# Altium schematic sheet 3 - USB.SchDoc
size Tabloid
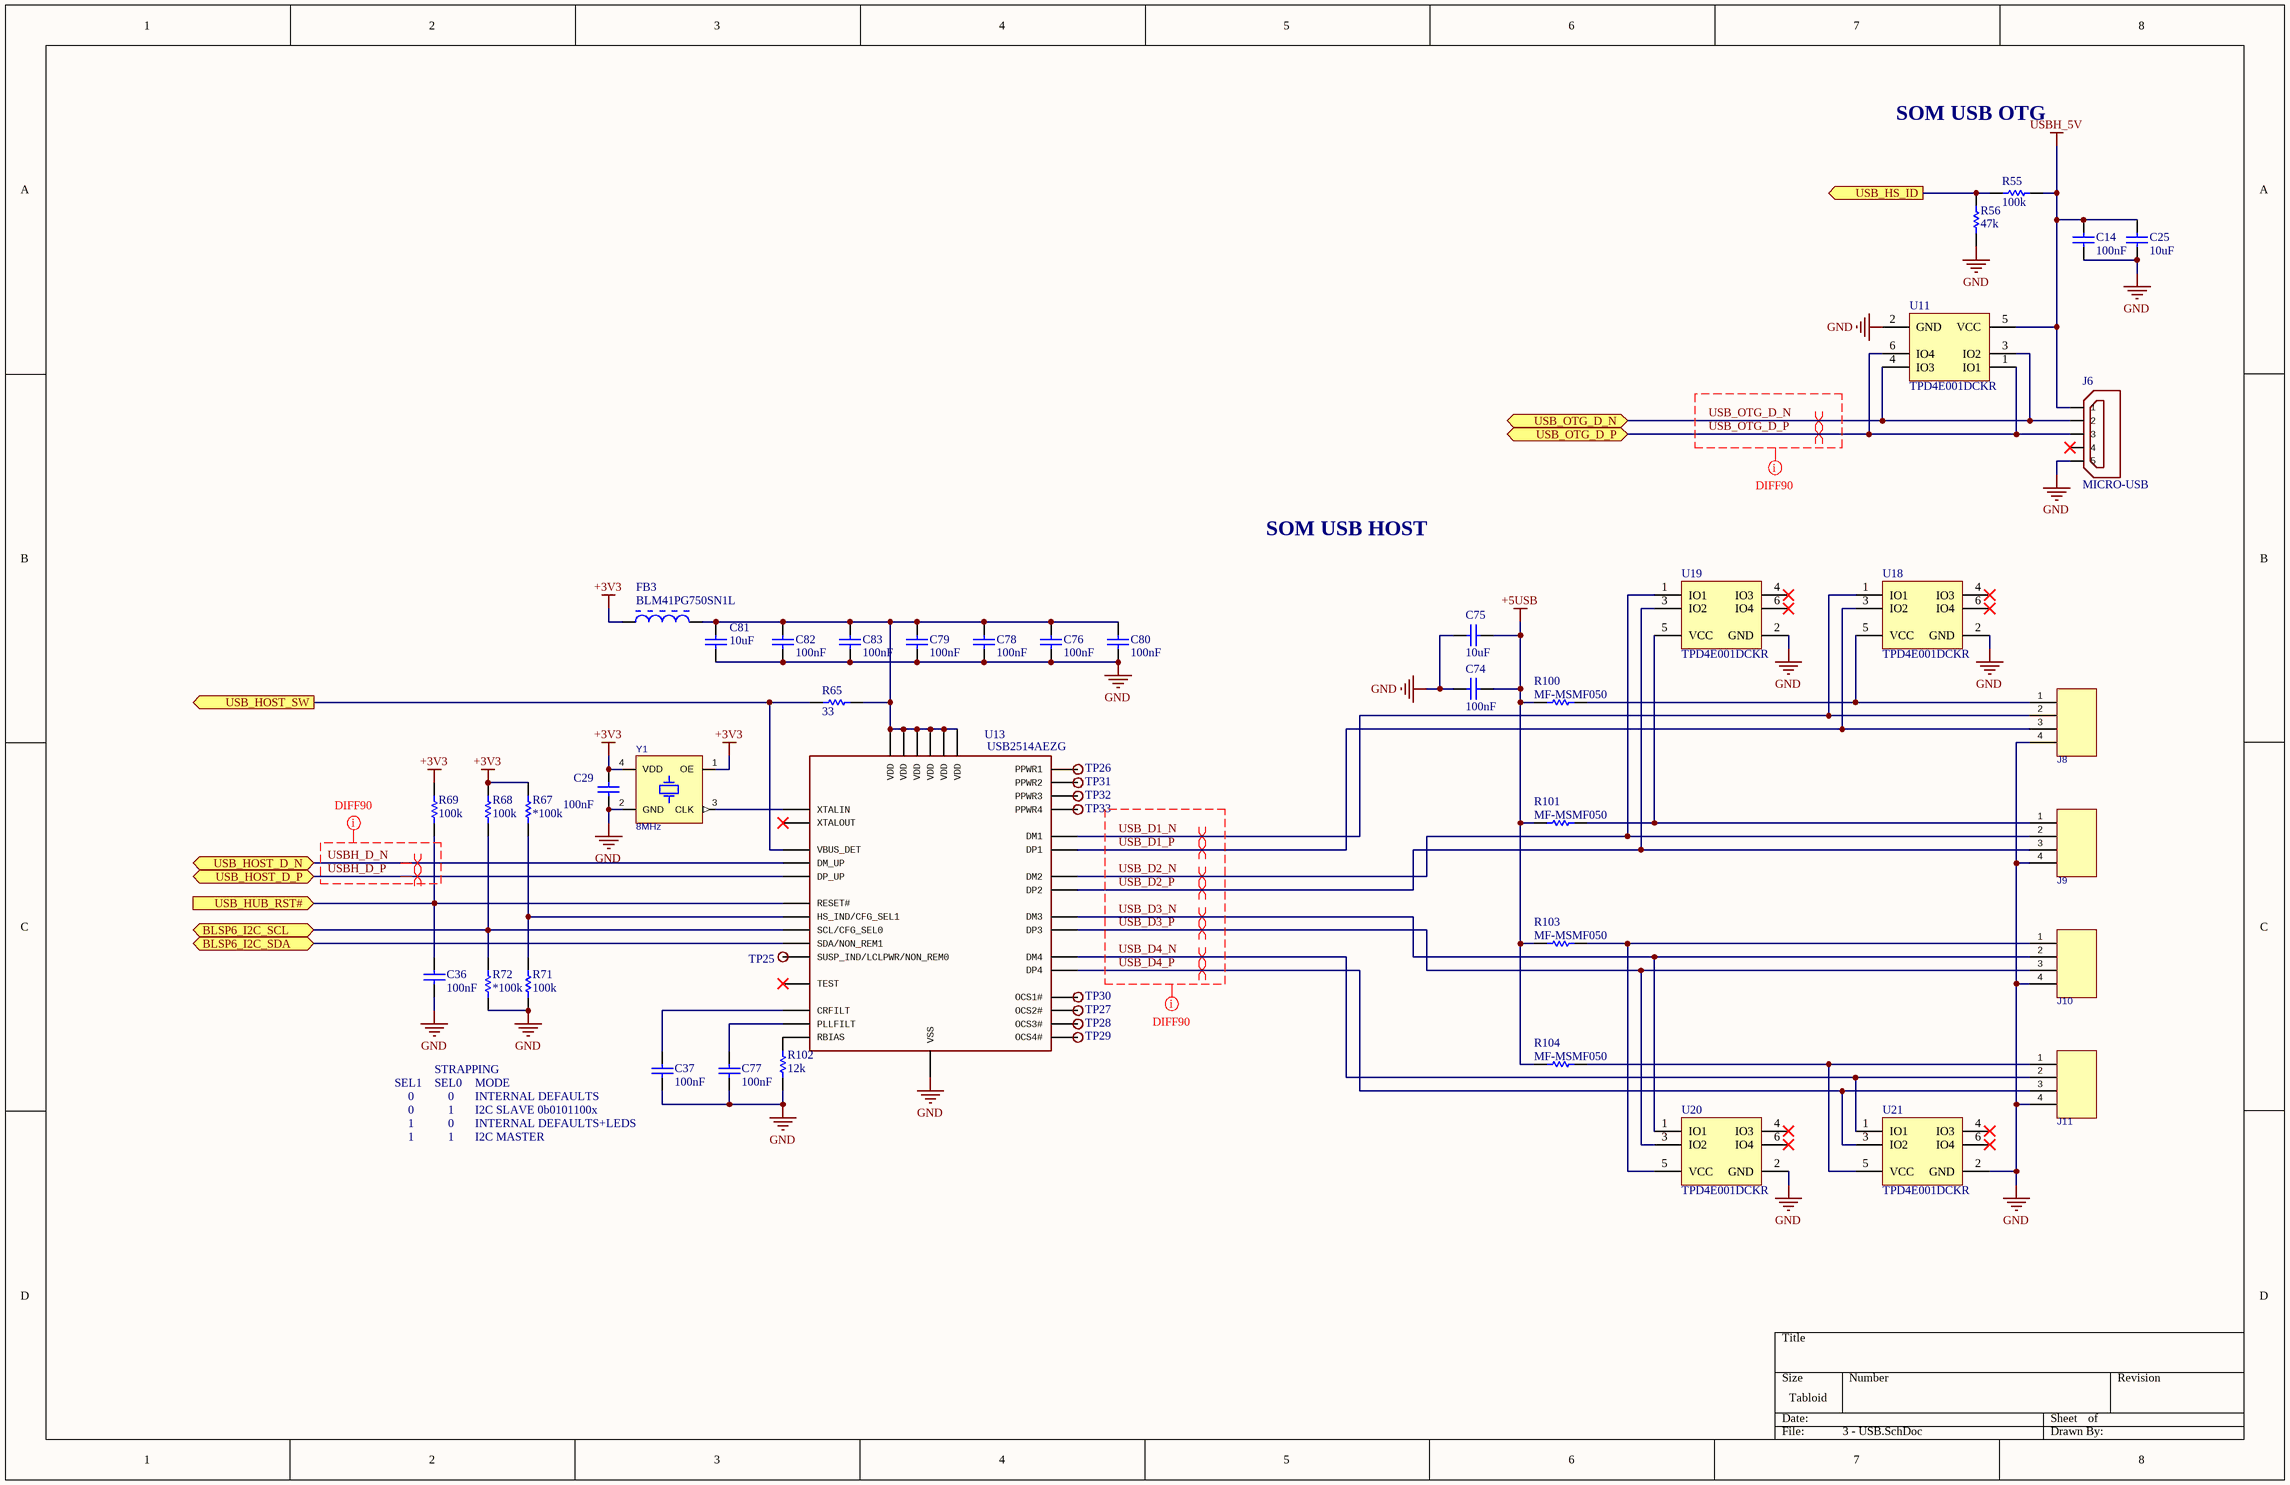
[diagram p0: 3 - USB.SchDoc]

## Parts
C14  value 100nF  [CAPC0805(2012)100_L]  (hidden comment: CAP 100nF 6.3V 0805(2012))
C25  value 10uF  [CAPC0805(2012)100_L]  (hidden comment: CAP 10uF 6.3V 0805(2012))
C29  value 100nF  [CAPC0805(2012)100_L]  (hidden comment: CAP 100nF 6.3V 0805(2012))
C36  value 100nF  [CAPC0805(2012)100_L]  (hidden comment: CAP 100nF 6.3V 0805(2012))
C37  value 100nF  [CAPC0805(2012)100_L]  (hidden comment: CAP 100nF 6.3V 0805(2012))
C74  value 100nF  [CAPC0805(2012)100_L]  (hidden comment: CAP 100nF 6.3V 0805(2012))
C75  value 10uF  [CAPC0805(2012)100_L]  (hidden comment: CAP 10uF 6.3V 0805(2012))
C76  value 100nF  [CAPC0805(2012)100_L]  (hidden comment: CAP 100nF 6.3V 0805(2012))
C77  value 100nF  [CAPC0805(2012)100_L]  (hidden comment: CAP 100nF 6.3V 0805(2012))
C78  value 100nF  [CAPC0805(2012)100_L]  (hidden comment: CAP 100nF 6.3V 0805(2012))
C79  value 100nF  [CAPC0805(2012)100_L]  (hidden comment: CAP 100nF 6.3V 0805(2012))
C80  value 100nF  [CAPC0805(2012)100_L]  (hidden comment: CAP 100nF 6.3V 0805(2012))
C81  value 10uF  [CAPC0805(2012)100_L]  (hidden comment: CAP 10uF 6.3V 0805(2012))
C82  value 100nF  [CAPC0805(2012)100_L]  (hidden comment: CAP 100nF 6.3V 0805(2012))
C83  value 100nF  [CAPC0805(2012)100_L]  (hidden comment: CAP 100nF 6.3V 0805(2012))
FB3  BLM41PG750SN1L  [MURA-BLM41-B35-CHIP-2_V2]
J6  MICRO-USB  [USB_MICRO_B_SMT]
J8  DF13-4P-1.25DS(20)  [HRS_DF13-4P-1.25DS(20)]  (value not drawn)
J9  DF13-4P-1.25DS(20)  [HRS_DF13-4P-1.25DS(20)]  (value not drawn)
J10  DF13-4P-1.25DS(20)  [HRS_DF13-4P-1.25DS(20)]  (value not drawn)
J11  DF13-4P-1.25DS(20)  [HRS_DF13-4P-1.25DS(20)]  (value not drawn)
R55  100k  [RESC0805(2012)_L]
R56  value 47k  [RESC0805(2012)_L]  (hidden comment: 47K 1% 0805(2012))
R65  value 33  [RESC0805(2012)_L]  (hidden comment: 33R 1% 0805(2012))
R67  value *100k  [RESC0805(2012)_L]  (hidden comment: 100k)
R68  100k  [RESC0805(2012)_L]
R69  100k  [RESC0805(2012)_L]
R71  100k  [RESC0805(2012)_L]
R72  value *100k  [RESC0805(2012)_L]  (hidden comment: 100k)
R100  MF-MSMF050  [BOUR-MF-MSMF050-2_V]
R101  MF-MSMF050  [BOUR-MF-MSMF050-2_V]
R102  12k  [RESC0805(2012)_L]
R103  MF-MSMF050  [BOUR-MF-MSMF050-2_V]
R104  MF-MSMF050  [BOUR-MF-MSMF050-2_V]
TP25  Various test points  [VIAHOLE20]  (value not drawn)
TP26  Various test points  [VIAHOLE20]  (value not drawn)
TP27  Various test points  [VIAHOLE20]  (value not drawn)
TP28  Various test points  [VIAHOLE20]  (value not drawn)
TP29  Various test points  [VIAHOLE20]  (value not drawn)
TP30  Various test points  [VIAHOLE20]  (value not drawn)
TP31  Various test points  [VIAHOLE20]  (value not drawn)
TP32  Various test points  [VIAHOLE20]  (value not drawn)
TP33  Various test points  [VIAHOLE20]  (value not drawn)
U11  TPD4E001DCKR  [DCK0006A_M]
U13  USB2514AEZG  [QFN36]
U18  TPD4E001DCKR  [DCK0006A_M]
U19  TPD4E001DCKR  [DCK0006A_M]
U20  TPD4E001DCKR  [DCK0006A_M]
U21  TPD4E001DCKR  [DCK0006A_M]
Y1  8MHz  [OSC_DFN165P250X90-4N]

## Ports
BLSP6_I2C_SCL (bidir), BLSP6_I2C_SDA (bidir), USB_HOST_D_N, USB_HOST_D_P, USB_HOST_SW (out), USB_HS_ID (out), USB_HUB_RST# (in), USB_OTG_D_N, USB_OTG_D_P

## Nets
+3V3: C29.1 FB3.1 R67.2 R68.2 R69.2 Y1.1(OE) Y1.4(VDD)
+5USB: C74.1 C75.2 R100.1 R101.1 R103.1 R104.1
GND: C14.2 C25.2 C29.2 C36.1 C37.1 C74.2 C75.1 C76.1 C77.1 C78.1 C79.1 C80.1 C81.1 C82.1 C83.1 J6.ID(5) J8.4 J9.4 J10.4 J11.4 R56.1 R71.1 R72.1 R102.1 U11.2(GND) U13.PAD(VSS) U18.2(GND) U19.2(GND) U20.2(GND) U21.2(GND) Y1.2(GND)
USBH_5V: C14.1 C25.1 J6.VBUS(1) R55.1 U11.5(VCC)
BLSP6_I2C_SCL: R68.1 R72.2 U13.24(SCL/CFG_SEL0) ; port BLSP6_I2C_SCL
BLSP6_I2C_SDA: U13.22(SDA/NON_REM1) ; port BLSP6_I2C_SDA
USB_D1_N: J8.2 U13.1(DM1) U18.1(IO1)
USB_D1_P: J8.3 U13.2(DP1) U18.3(IO2)
USB_D2_N: J9.2 U13.3(DM2) U19.1(IO1)
USB_D2_P: J9.3 U13.4(DP2) U19.3(IO2)
USB_D3_N: J10.2 U13.6(DM3) U20.1(IO1)
USB_D3_P: J10.3 U13.7(DP3) U20.3(IO2)
USB_D4_N: J11.2 U13.8(DM4) U21.1(IO1)
USB_D4_P: J11.3 U13.9(DP4) U21.3(IO2)
USB_HOST_SW: R65.2 U13.27(VBUS_DET) ; port USB_HOST_SW
USB_HS_ID: R55.2 R56.2 ; port USB_HS_ID
USB_HUB_RST#: C36.2 R69.1 U13.26(RESET#) ; port USB_HUB_RST#
USB_OTG_D_N: J6.D-(2) U11.3(IO2) U11.4(IO3) ; port USB_OTG_D_N
USB_OTG_D_P: J6.D+(3) U11.1(IO1) U11.6(IO4) ; port USB_OTG_D_P
USBH_D_N: U13.30(DM_UP) ; port USB_HOST_D_N
USBH_D_P: U13.31(DP_UP) ; port USB_HOST_D_P
NetC37_2: C37.2 U13.14(CRFILT)
NetC76_2: C76.2 C78.2 C79.2 C80.2 C81.2 C82.2 C83.2 FB3.2 R65.1 U13.5(VDD) U13.10(VDD) U13.15(VDD) U13.23(VDD) U13.29(VDD) U13.36(VDD)
NetC77_2: C77.2 U13.34(PLLFILT)
NetJ8_1: J8.1 R100.2 U18.5(VCC)
NetJ9_1: J9.1 R101.2 U19.5(VCC)
NetJ10_1: J10.1 R103.2 U20.5(VCC)
NetJ11_1: J11.1 R104.2 U21.5(VCC)
NetR67_1: R67.1 R71.2 U13.25(HS_IND/CFG_SEL1)
NetR102_2: R102.2 U13.35(RBIAS)
NetTP25_1: TP25.1 U13.28(SUSP_IND/LCLPWR/NON_REM0)
NetTP26_1: TP26.1 U13.12(PPWR1)
NetTP27_1: TP27.1 U13.17(OCS2#)
NetTP28_1: TP28.1 U13.19(OCS3#)
NetTP29_1: TP29.1 U13.21(OCS4#)
NetTP30_1: TP30.1 U13.13(OCS1#)
NetTP31_1: TP31.1 U13.16(PPWR2)
NetTP32_1: TP32.1 U13.18(PPWR3)
NetTP33_1: TP33.1 U13.20(PPWR4)
NetU13_33: U13.33(XTALIN) Y1.3(CLK)

Not connected (* = marked no-connect by the designer): J6 GND(4)*; U13 11(TEST)* 32(XTALOUT)*; U18 4(IO3)* 6(IO4)*; U19 4(IO3)* 6(IO4)*; U20 4(IO3)* 6(IO4)*; U21 4(IO3)* 6(IO4)*

## Layout directives
differential pair: USB_D1_N, USB_D1_P, USB_D2_N, USB_D2_P, USB_D3_N, USB_D3_P, USB_D4_N, USB_D4_P, USB_OTG_D_N, USB_OTG_D_P, USBH_D_N, USBH_D_P
net class DIFF90: USB_D1_N, USB_D1_P, USB_D2_N, USB_D2_P, USB_D3_N, USB_D3_P, USB_D4_N, USB_D4_P, USB_OTG_D_N, USB_OTG_D_P, USBH_D_N, USBH_D_P

## Notes on the sheet
- SOM USB OTG
- SOM USB HOST
- SEL1
- 0
- STRAPPING
- SEL0
- INTERNAL DEFAULTS
- MODE
- 1
- I2C SLAVE 0b0101100x
- INTERNAL DEFAULTS+LEDS
- I2C MASTER

## Library data of the parts
C14 C29 C36 C37 C74 C76-C80 C82 C83 = CMP-1036-04391-1: CAP 100nF 6.3V Â±10% 0805 (2012 Metric) Thickness 1mm SMD; Case-EIA: 0805; Case-Metric: 2012; Rated Voltage: 6.3 V; Technology: SMT; Tolerance: Â±10%; Max Thickness: 1 mm
C25 C75 = CMP-1036-04917-1: CAP 10uF 6.3V Â±10% 0805 (2012 Metric) Thickness 1mm SMD; Case-EIA: 0805; Case-Metric: 2012; Max Thickness: 1 mm; Tolerance: Â±10%; Technology: SMT; Rated Voltage: 6.3 V
C81 = CMP-1036-04920-1: CAP 10uF 6.3V Â±20% 0805 (2012 Metric) Thickness 1mm SMD; Case-Metric: 2012; Case-EIA: 0805; Max Thickness: 1 mm; Tolerance: Â±20%; Rated Voltage: 6.3 V; Technology: SMT
FB3 = CMP-0686-00749-2: Chip Ferrite Bead for Power Lines, 75 Ohm, 3500 mA, -55 to 125 degC, 4.5 x 1.6 x 1.8 mm SMD, Tape and Reel; Manufacturer: Murata; Rated Current: 3500 mA; Impedance (at 100 MHz): 75 Ohm Typ.; DC Resistance: 0.015 Ohm Max.; PackageReference: BLM41-2; Packing: Tape and Reel; PartNumber: BLM41PG750SN1L; ComponentLink1URL: http://www.murata.com/; ComponentLink3Description: Package Specification; ComponentLink1Description: Manufacturer URL; ComponentLink3URL: http://www.murata.com/products/catalog/pdf/c31e.pdf; DatasheetVersion: 08/2013; PackageDescription: 2-Pin Chip, Body 4.5 x 1.6 mm; Operating Temperature Range: -55 to 125 degC; Mounting Technology: Surface Mount; ComponentLink2URL: http://www.murata.com/products/catalog/pdf/c31e.pdf; ComponentLink2Description: Datasheet
J6 = MICRO-USB: pin to pad: D+>3 D->2 GND>4 ID>5 VBUS>1
J8-J11 = CON_HRS_DF13-4P-1.25DS(20): CONN HEADER 4POS 1.25MM R/A THT TIN; Manufacturer: Hirose Electric Co Ltd; Connector Type: Header, Shrouded; Number of Positions: 4; Number of Positions Loaded: All; Pitch: 0.049" (1.25mm); Supplier 1: Digi-Key; Manufacturer Part Number: DF13-4P-1.25DS(20); RoHS: RoHS Compliant; Category: Connectors, Interconnects; Stock 1: 6051; Pricing 1: 1=0.51, 10=0.48, 50=0.384, 100=0.368, 250=0.336, 500=0.32, 1000=0.264, 2500=0.24, 5000=0.232 (USD); Packaging: Tube; Contact Type: Male Pin; Number of Rows: 1; Row Spacing: -; Contact Mating Length: -; Mounting Type: Through Hole, Right Angle; Termination: Solder; Fastening Type: -; Features: Board Guide; Contact Finish: Tin; Contact Finish Thickness: -; Color: Beige; ComponentLink1URL: http://www.hirose.co.jp/cataloge_hp/2d/EDC3-081817-01.pdf; ComponentLink1Description: http://www.hirose.co.jp/cataloge_hp/2d/EDC3-081817-01.pdf; Supplier Part Number 1: H2201-ND
R55 R67-R69 R71 R72 R102 = CMP-1013-00623-1: 10K 0.125W 1% 0805 (2012 Metric)  SMD; Case-Metric: 2012; Case-EIA: 0805; Tolerance: 1 %; Power: 0.125 W; Technology: SMT
  R55 R68 R69 R71: Value: 100k
  R102: Value: 12k
R56 = CMP-1013-00699-1: 47K 0.125W 1% 0805 (2012 Metric)  SMD; Case-Metric: 2012; Case-EIA: 0805; Power: 0.125 W; Tolerance: 1 %; Technology: SMT
R65 = CMP-1013-00341-1: 33R 0.125W 1% 0805 (2012 Metric)  SMD; Case-EIA: 0805; Case-Metric: 2012; Technology: SMT; Power: 0.125 W; Tolerance: 1 %
R100 R101 R103 R104 = CMP-0280-00002-2: MF-MSMF Series - PTC Resettable Fuse, 15 V Max, 0.15 Ohm Min, -40 to 85 degC, RoHS, Reel; Manufacturer: Bourns; Voltage DC (Max): 15 V; Trip Current: 1 A; Hold Current: 0.5 A; Current Rating (Max): 100 A; ComponentLink1Description: Manufacturer URL; Operating Temperature Range: -40 to 85 degC; ComponentLink2URL: http://www.bourns.com/data/global/pdfs/mfmsmf.pdf; PackageReference: MF-MSMF050; ComponentLink2Description: Datasheet; PartNumber: MF-MSMF050; DatasheetVersion: Rev. AD; ComponentLink3URL: http://www.bourns.com/data/global/pdfs/mfmsmf.pdf; ComponentLink3Description: Package Specification; RoHS: TRUE; PackageDescription: 2-Pin SMD, Body 4.55 x 3.24 mm; Mounting Technology: Surface Mount; Packing: Reel; Resistance (Min): 0.15 Ohm; ComponentLink1URL: http://www.bourns.com/
TP25-TP33 = TESTPOINTHOLE035
U11 U18-U21 = CMP-0326-00066-2: Low-Capacitance + / - 15-kV ESD Protection Array for High-Speed Data Interfaces, 4 Channels, -40 to +85 degC, 6-pin SOT70 (DCK), Green (RoHS & no Sb/Br); Manufacturer: Texas Instruments; IO Leakage Current(nA): 1.5; IEC 61000-4-2 Air-Gap(+/- kV): 15; USB High Speed: TRUE; SubFamily: ESD Solution; IEC 61000-4-2 Contact(+/- kV): 8; Breakdown Voltage(Min)(V): 11; Mounting Technology: Surface Mount; DatasheetVersion: SLLS682G; ComponentLink1URL: http://www.ti.com/; Serial ATA / eSATA: TRUE; PackageReference: DCK0006A; ComponentLink3Description: URL Link1; ComponentLink2Description: Datasheet; 1394 / Firewire: TRUE; ComponentLink2URL: http://www.ti.com/general/docs/lit/getliterature.tsp?genericPartNumber=TPD4E001&fileType=pdf; ComponentLink1Description: Manufacturer URL; PackageVersion: revG, Jan-2007; ComponentLink3URL: SamplesURL:http://www.ti.com/product/tpd4e001#samples; PackageDescription: 6-Pin Plastic Small-Outline Package, 2 x 1.3 mm Body, 0.65 mm Pitch, 2.1 mm Lead Span; IO Capacitance(Typ)(pF): 1.5; PartNumber: TPD4E001DCKR; Eco-Plan: Green (RoHS & no Sb/Br)
Y1 = OSC_MEMS_8.000MHZ: OSC CMEMS 8.000MHZ LVCMOS SMD; Manufacturer: Silicon Labs; Manufacturer Part Number: 501ABA8M00000DAG; Function: Tri-State (Output Enable); Voltage - Supply: 1.7 V ~ 3.6 V; Frequency Stability: ±30ppm; Current - Supply (Max): 2.5mA; Supplier 1: Digi-Key; RoHS: RoHS Compliant; Category: Crystals and Oscillators; Stock 1: 150; Pricing 1: 1=1.04, 10=0.92, 50=0.86, 100=0.76, 500=0.72, 1000=0.6, 2500=0.58, 5000=0.56 (USD); Packaging: Cut Strip; Type: CMEMS®; Frequency: 8MHz; Output: LVCMOS; Operating Temperature: -40°C ~ 85°C; Ratings: -; Mounting Type: Surface Mount; Size / Dimension: 0.098" L x 0.079" W (2.50mm x 2.00mm); Height: 0.035" (0.90mm); Package / Case: 4-SMD, No Lead (DFN, LCC); Current - Supply (Disable) (Max): 2.5mA; ComponentLink1URL: http://www.silabs.com/Support%20Documents/TechnicalDocs/Si501-2-3.pdf; ComponentLink1Description: http://www.silabs.com/Support%20Documents/TechnicalDocs/Si501-2-3.pdf; Supplier Part Number 1: 336-2873-ND